# EAGLE design sdr_3157 (EAGLE 9.6.2)
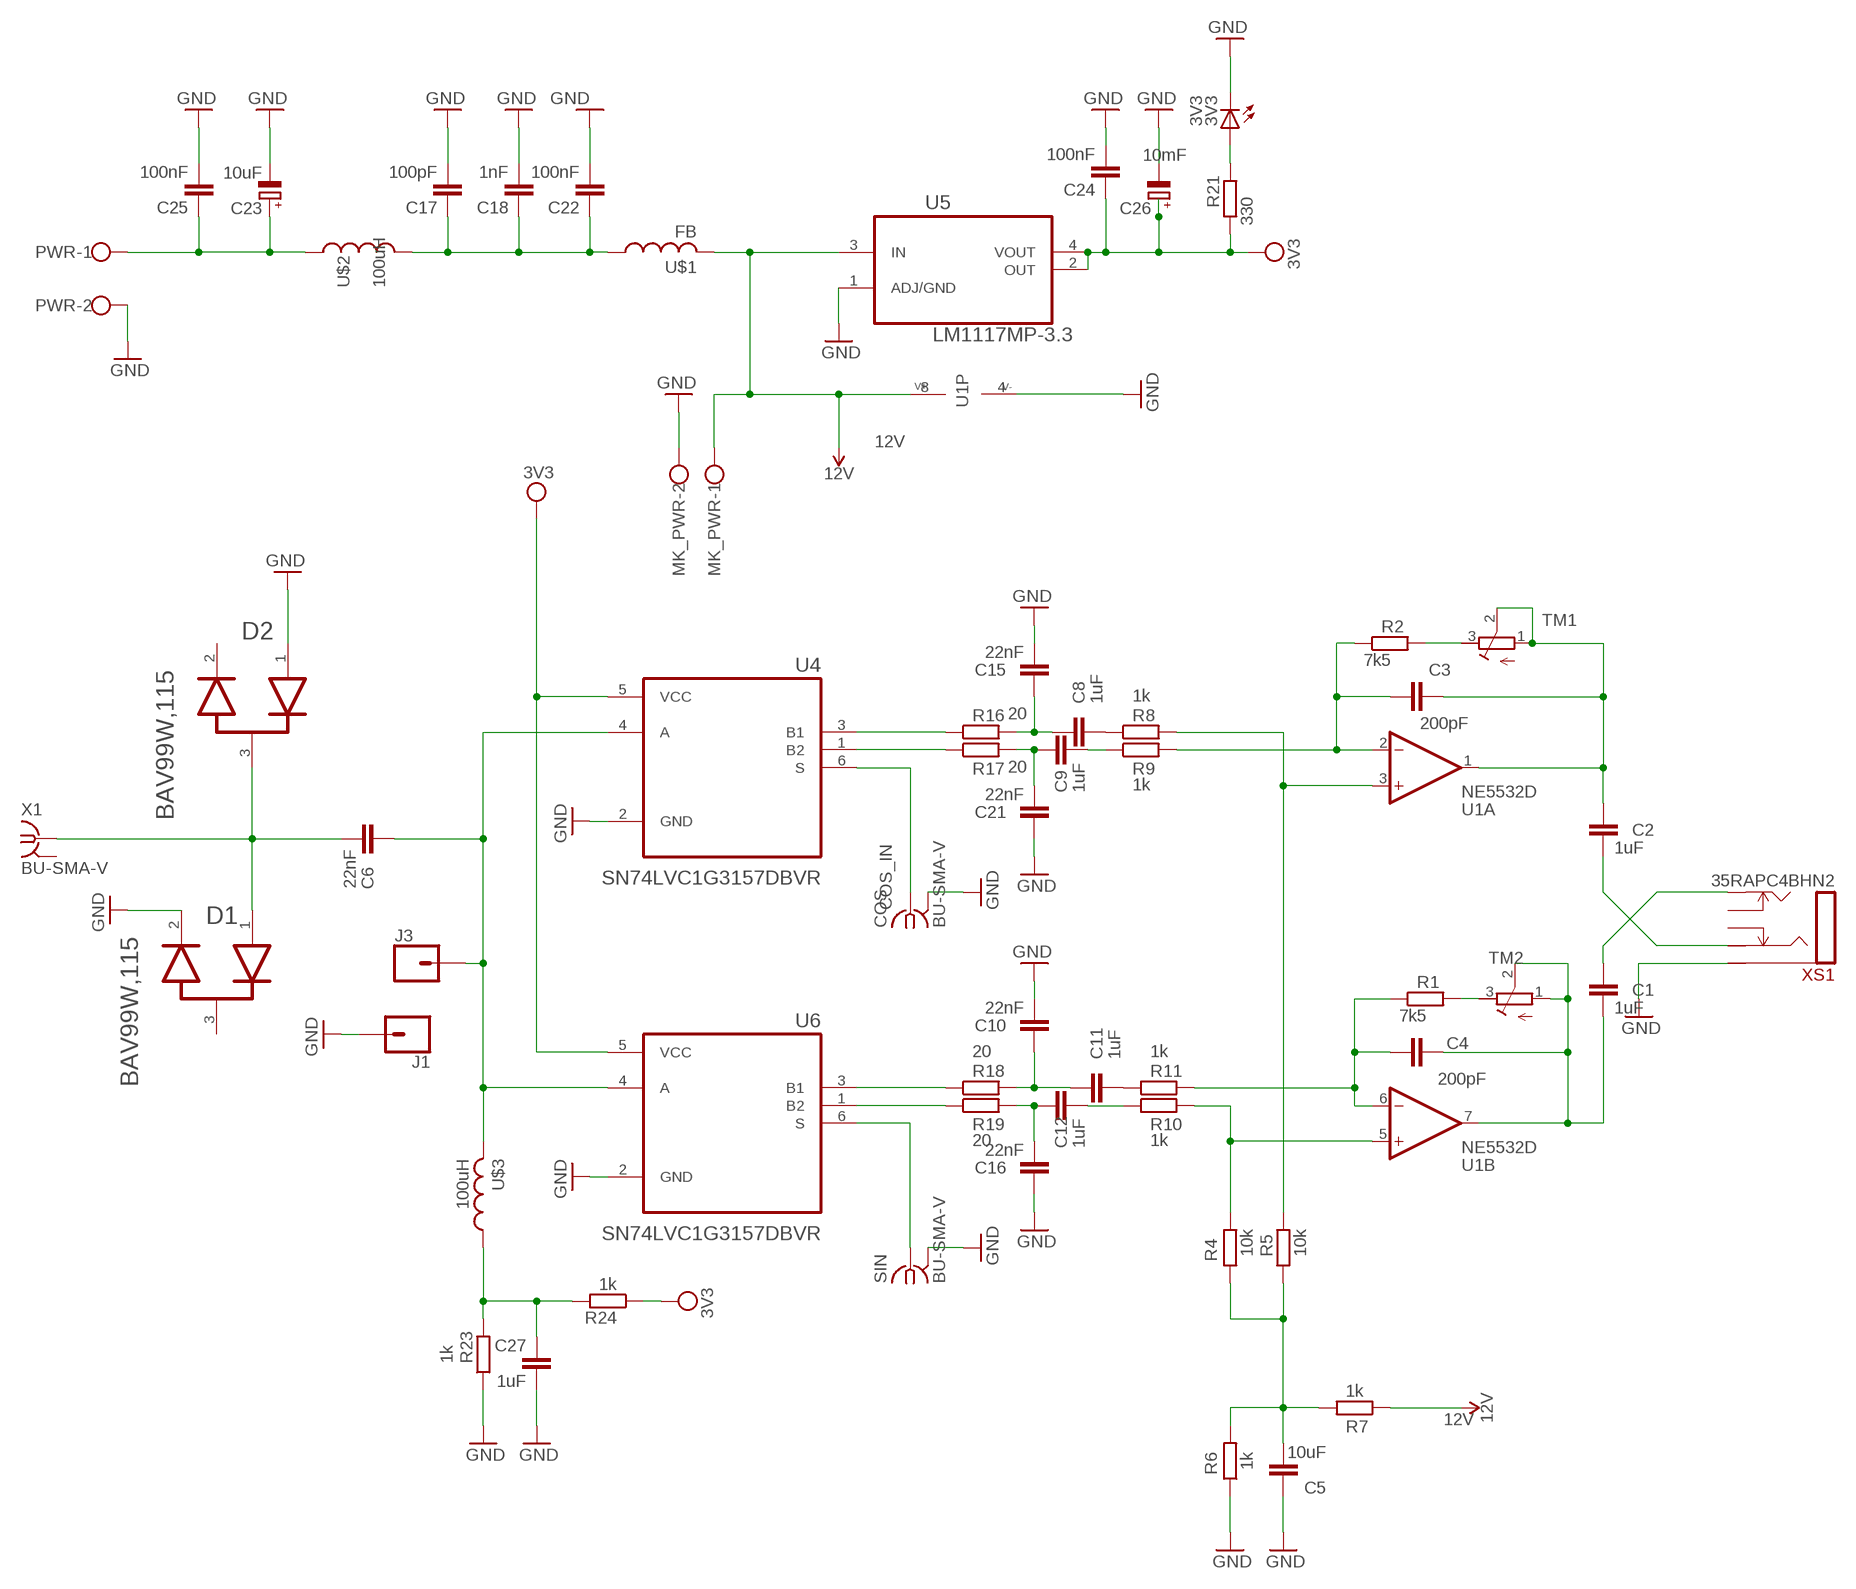
[diagram p0: schematic, sheet 1]

## Parts
3V3  3V3  LEDSMT1206  [1206]
C1  1uF  C-EU050-045X075  [C050-045X075]
C2  1uF  C-EU050-045X075  [C050-045X075]
C3  200pF  C-EU050-045X075  [C050-045X075]
C4  200pF  C-EU050-045X075  [C050-045X075]
C5  10uF  C-EUC0805  [C0805]
C6  22nF  C-EUC0805  [C0805]
C8  1uF  C-EUC0805  [C0805]
C9  1uF  C-EUC0805  [C0805]
C10  22nF  C-EUC0805  [C0805]
C11  1uF  C-EUC0805  [C0805]
C12  1uF  C-EUC0805  [C0805]
C15  22nF  C-EUC0805  [C0805]
C16  22nF  C-EUC0805  [C0805]
C17  100pF  C-EUC0805  [C0805]
C18  1nF  C-EUC0805  [C0805]
C21  22nF  C-EUC0805  [C0805]
C22  100nF  C-EUC0805  [C0805]
C23  10uF  CPOL-EUSMCC  [SMC_C]
C24  100nF  C-EUC0805  [C0805]
C25  100nF  C-EUC0805  [C0805]
C26  10mF  CPOL-EUSMCC  [SMC_C]
C27  1uF  C-EUC0805  [C0805]
COS  BU-SMA-V  [BU-SMA-V]
D1  NEXPERIA_BAV99W,115NEXPERIA_BAV99W,115_0_0  [NEXPERIA_BAV99W,115_0]
D2  NEXPERIA_BAV99W,115NEXPERIA_BAV99W,115_0_0  [NEXPERIA_BAV99W,115_0]
J1  CONN_01PTH_NO_SILK_SMALL  [1X01_SMALL]
J3  CONN_01PTH_NO_SILK_SMALL  [1X01_SMALL]
MK_PWR  W237-102  [W237-102]
PWR  W237-102  [W237-102]
R1  7k5  R-EU_R0805  [R0805]
R2  7k5  R-EU_R0805  [R0805]
R4  10k  R-EU_M0805  [M0805]
R5  10k  R-EU_R0805  [R0805]
R6  1k  R-EU_M0805  [M0805]
R7  1k  R-EU_M0805  [M0805]
R8  1k  R-EU_R0805  [R0805]
R9  1k  R-EU_R0805  [R0805]
R10  1k  R-EU_R0805  [R0805]
R11  1k  R-EU_M0805  [M0805]
R16  20  R-EU_R0805  [R0805]
R17  20  R-EU_R0805  [R0805]
R18  20  R-EU_R0805  [R0805]
R19  20  R-EU_R0805  [R0805]
R21  330  R-EU_R0805  [R0805]
R23  1k  R-EU_R0805  [R0805]
R24  1k  R-EU_R0805  [R0805]
SIN  BU-SMA-V  [BU-SMA-V]
TM1  5k  R-TRIMM3296W  [RTRIM3296W]
TM2  5k  R-TRIMM3296W  [RTRIM3296W]
U1  NE5532D  [SO08]
U4  SN74LVC1G3157DBVR  [SOT95P280X145-6N]
U5  LM1117MP-3.3  [SOT230P696X180-4N]
U6  SN74LVC1G3157DBVR  [SOT95P280X145-6N]
U$1  FB  [FB]
U$2  100uH  IHLP4040  [IHLP4040]
U$3  100uH  L-LQH55  [LQH55]
X1  BU-SMA-V  [BU-SMA-V]
XS1  35RAPC4BHN2  [35RAP]

## Nets
12V: MK_PWR.1 R7.1 U1.8(P:V+) U5.3(IN) U$1.P$2
ANTENNA: C6.1 J3.P$1 U4.4(A) U6.4(A) U$3.2
COS_IN: COS.1 U4.6(S)
GND: 3V3.C C5.1 C10.2 C15.2 C16.1 C17.2 C18.2 C21.1 C22.2 C23.- C24.2 C25.2 C26.- C27.1 COS.2 COS.3 COS.4 COS.5 D1.2(2_CATHODE) D2.1(1_ANODE) J1.P$1 MK_PWR.2 PWR.2 R6.1 R23.1 SIN.2 SIN.3 SIN.4 SIN.5 U1.4(P:V-) U4.2(GND) U5.1(ADJ/GND) U6.2(GND) XS1.1(S)
N$1: C6.2 D1.1(1_ANODE) D2.3(1_CATHODE/2_ANODE) X1.1
N$3: R16.1 U4.3(B1)
N$4: R17.1 U4.1(B2)
N$5: R18.1 U6.3(B1)
N$7: R19.1 U6.1(B2)
N$8: C8.1 C15.1 R16.2
N$9: C9.1 C21.2 R17.2
N$10: C10.1 C11.1 R18.2
N$11: C12.1 C16.2 R19.2
N$12: C8.2 R8.1
N$13: C9.2 R9.1
N$14: C11.2 R11.1
N$15: C12.2 R10.1
N$16: R5.2 R8.2 U1.3(A:+IN)
N$17: C3.1 R2.1 R9.2 U1.2(A:-IN)
N$18: R4.2 R10.2 U1.5(B:+IN)
N$19: C4.1 R1.1 R11.2 U1.6(B:-IN)
N$20: C5.2 R4.1 R5.1 R6.2 R7.2
N$21: C2.1 C3.2 TM1.1(A) TM1.2(S) U1.1(A:OUT)
N$22: C2.2 XS1.3(R)
N$23: C1.1 XS1.2(T)
N$24: C1.2 C4.2 TM2.1(A) TM2.2(S) U1.7(B:OUT)
N$25: C27.2 R23.2 R24.2 U$3.1
N$26: 3V3.A R21.2
N$28: R2.2 TM1.3(E)
N$31: SIN.1 U6.6(S)
N$32: C23.+ C25.1 PWR.1 U$2.1
N$33: C17.1 C18.1 C22.1 U$1.P$1 U$2.2
N$41: R1.2 TM2.3(E)
VCC: C24.1 C26.+ R21.1 R24.1 U4.5(VCC) U5.2(OUT) U5.4(VOUT) U6.5(VCC) ; supply symbol labelled 3V3
Unconnected: D1.3(1_CATHODE/2_ANODE) D2.2(2_CATHODE) X1.2 X1.3 X1.4 X1.5 XS1.10(TN) XS1.11(RN)

## Library data of the parts
3V3 = adafruit:LED: LED OSRAM: - CHIPLED LG R971, LG N971, LY N971, LG Q971, LY Q971, LO R971, LY R971 LH N974, LH R974 LS Q976, LO Q976, LY Q976 LO Q996 - Hyper CHIPLED LW Q18S LB Q993, LB Q99A, LB R99A - SideLED LS A670, LO A670, LY A670, LG A670, LP A670 LB A673, LV A673, LT A673, LW A673 LH A674 LY A675 LS A676, LA A676, LO A676, LY A676, LW A676 LS A679, LY A679, LG A679 - Hyper Micro SIDELED® LS Y876, LA Y876, LO Y876, LY Y876 LT Y87S - SmartLED LW L88C, LW L88S LB L89C, LB L89S, LG L890 LS L89K, LO L89K, LY L89K LS L896, LA L896, LO L896, LY L896 - TOPLED LS T670, LO T670, LY T670, LG T670, LP T670 LSG T670, LSP T670, LSY T670, LOP T670, LYG T670 LG T671, LOG T671, LSG T671 LB T673, LV T673, LT T673, LW T673 LH T674 LS T676, LA T676, LO T676, LY T676, LB T676, LH T676, LSB T676, LW T676 LB T67C, LV T67C, LT T67C, LS T67K, LO T67K, LY T67K, LW E67C LS E67B, LA E67B, LO E67B, LY E67B, LB E67C, LV E67C, LT E67C LW T67C LS T679, LY T679, LG T679 LS T770, LO T770, LY T770, LG T770, LP T770 LB T773, LV T773, LT T773, LW T773 LH T774 LS E675, LA E675, LY E675, LS T675 LS T776, LA T776, LO T776, LY T776, LB T776 LHGB T686 LT T68C, LB T68C - Hyper Mini TOPLED® LB M676 - Mini TOPLED Santana® LG M470 LS M47K, LO M47K, LY M47K Source: http://www.osram.convergy.de/
C1-C6 C8-C12 C15-C18 C21 C22 C24 C25 C27 = rcl:C-EU: CAPACITOR, European symbol; SPICEPREFIX: C
C23 C26 = rcl:CPOL-EU: POLARIZED CAPACITOR, European symbol; SPICEPREFIX: C
COS SIN X1 = con-coax:BU-SMA-V: FEMALE SMA CONNECTOR Radiall distributor RS 112-3794; OC_FARNELL: unknown; OC_NEWARK: unknown
D1 D2 = Nexperia - BAV99W,115:NEXPERIA_BAV99W,115: High-speed switching diodes; 3DS_PART_NUMBER: 412-00001; AMBIENT_TEMPERATURE_RANGE_HIGH: +150°C; AMBIENT_TEMPERATURE_RANGE_LOW: -65°C; CAPACITANCE: 1.5pF; CENTROID_NOT_SPECIFIED: No; DATASHEET: https://assets.nexperia.com/documents/data-sheet/BAV99_SER.pdf; DEVICE_CLASS_L1: Discrete Semiconductors; DEVICE_CLASS_L2: Diodes; DEVICE_CLASS_L3: Rectifier Diodes; DIGIKEY_DESCRIPTION: DIODE ARRAY GP 100V 150MA SOT323; DIGIKEY_PART_NUMBER: 1727-2915-1-ND; FOOTPRINT_PARAMETERS_0: {"fp_type":"SOT23","params":{"N":{"default":"3","long name":"Number of leads","type":"multichoice","short name":"N"},"A":{"nom":false,"long name":"Height","min":800000,"max":1100000,"short name":"A","type":"measurement"},"A1":{"nom":false,"long name":"Package clearance","min":false,"max":100000,"short name":"A1","type":"measurement"},"A2":{"nom":false,"long name":"Package height","min":false,"max":1000000,"short name":"A2","type":"measurement"},"D":{"nom":false,"long name":"Package length","min":1800000,"max":2200000,"short name":"D","type":"measurement"},"E":{"nom":false,"long name":"Width /w leads","min":2000000,"max":2200000,"short name":"E","type":"measurement"},"E1":{"nom":false,"long name":"Package width","min":1150000,"max":1350000,"short name":"E1","type":"measurement"},"B":{"nom":false,"long name":"Lead width","min":300000,"max":400000,"short name":"B","type":"measurement"},"C":{"nom":false,"long name":"Lead thickness","min":100000,"max":250000,"short name":"C","type":"measurement"},"L":{"nom":false,"long name":"Lead foot length","min":150000,"max":450000,"short name":"L","type":"measurement"},"e":{"nom":650000,"long name":"Lead pitch","min":null,"max":null,"short name":"e","type":"measurement"},"PHI":{"nom":false,"long name":"Lead angle","min":0,"max":8,"short name":"PHI","type":"measurement"},"offset x":{"nom":0,"long name":"X Center offset","min":null,"max":null,"short name":"offset x","type":"measurement"},"offset y":{"nom":0,"long name":"Y Center offset","min":null,"max":null,"short name":"offset y","type":"measurement"},"LS":{"default":"Rounded rectangle","long name":"Land shape","type":"multichoice","short name":"LS"},"LS1":{"default":"Rectangle","long name":"Land shape (Pin 1)","type":"multichoice","short name":"LS1"},"solder toe":{"nom":550000,"long name":"Solder fillet (toe)","min":null,"max":null,"short name":"solder toe","type":"fixedmeasurement"},"solder heel":{"nom":450000,"long name":"Solder fillet (heel)","min":null,"max":null,"short name":"solder heel","type":"fixedmeasurement"},"solder side":{"nom":50000,"long name":"Solder fillet (side)","min":null,"max":null,"short name":"solder side","type":"fixedmeasurement"},"courtyard":{"nom":500000,"long name":"Courtyard","min":null,"max":null,"short name":"courtyard","type":"fixedmeasurement"},"SF":{"default":"A","long name":"Packing level","type":"multichoiceparent","short name":"SF","help":"http://support.upverter.com/customer/portal/articles/978783-what-is-a-footprint-packing-level","children":["solder toe","solder heel","solder side","courtyard"]}}}; FOOTPRINT_PARAMETERS_1: {"fp_type":"SOT23","params":{"N":{"default":"3","long name":"Number of leads","type":"multichoice","short name":"N"},"A":{"nom":false,"long name":"Height","min":800000,"max":1100000,"short name":"A","type":"measurement"},"A1":{"nom":false,"long name":"Package clearance","min":false,"max":100000,"short name":"A1","type":"measurement"},"A2":{"nom":false,"long name":"Package height","min":false,"max":1000000,"short name":"A2","type":"measurement"},"D":{"nom":false,"long name":"Package length","min":1800000,"max":2200000,"short name":"D","type":"measurement"},"E":{"nom":false,"long name":"Width /w leads","min":2000000,"max":2200000,"short name":"E","type":"measurement"},"E1":{"nom":false,"long name":"Package width","min":1150000,"max":1350000,"short name":"E1","type":"measurement"},"B":{"nom":false,"long name":"Lead width","min":300000,"max":400000,"short name":"B","type":"measurement"},"C":{"nom":false,"long name":"Lead thickness","min":100000,"max":250000,"short name":"C","type":"measurement"},"L":{"nom":false,"long name":"Lead foot length","min":150000,"max":450000,"short name":"L","type":"measurement"},"e":{"nom":650000,"long name":"Lead pitch","min":null,"max":null,"short name":"e","type":"measurement"},"PHI":{"nom":false,"long name":"Lead angle","min":0,"max":8,"short name":"PHI","type":"measurement"},"offset x":{"nom":0,"long name":"X Center offset","min":null,"max":null,"short name":"offset x","type":"measurement"},"offset y":{"nom":0,"long name":"Y Center offset","min":null,"max":null,"short name":"offset y","type":"measurement"},"LS":{"default":"Rounded rectangle","long name":"Land shape","type":"multichoice","short name":"LS"},"LS1":{"default":"Rectangle","long name":"Land shape (Pin 1)","type":"multichoice","short name":"LS1"},"solder toe":{"nom":350000,"long name":"Solder fillet (toe)","min":null,"max":null,"short name":"solder toe","type":"fixedmeasurement"},"solder heel":{"nom":350000,"long name":"Solder fillet (heel)","min":null,"max":null,"short name":"solder heel","type":"fixedmeasurement"},"solder side":{"nom":30000,"long name":"Solder fillet (side)","min":null,"max":null,"short name":"solder side","type":"fixedmeasurement"},"courtyard":{"nom":250000,"long name":"Courtyard","min":null,"max":null,"short name":"courtyard","type":"fixedmeasurement"},"SF":{"default":"B","long name":"Packing level","type":"multichoiceparent","short name":"SF","help":"http://support.upverter.com/customer/portal/articles/978783-what-is-a-footprint-packing-level","children":["solder toe","solder heel","solder side","courtyard"]}}}; FOOTPRINT_PARAMETERS_2: {"fp_type":"SOT23","params":{"N":{"default":"3","long name":"Number of leads","type":"multichoice","short name":"N"},"A":{"nom":false,"long name":"Height","min":800000,"max":1100000,"short name":"A","type":"measurement"},"A1":{"nom":false,"long name":"Package clearance","min":false,"max":100000,"short name":"A1","type":"measurement"},"A2":{"nom":false,"long name":"Package height","min":false,"max":1000000,"short name":"A2","type":"measurement"},"D":{"nom":false,"long name":"Package length","min":1800000,"max":2200000,"short name":"D","type":"measurement"},"E":{"nom":false,"long name":"Width /w leads","min":2000000,"max":2200000,"short name":"E","type":"measurement"},"E1":{"nom":false,"long name":"Package width","min":1150000,"max":1350000,"short name":"E1","type":"measurement"},"B":{"nom":false,"long name":"Lead width","min":300000,"max":400000,"short name":"B","type":"measurement"},"C":{"nom":false,"long name":"Lead thickness","min":100000,"max":250000,"short name":"C","type":"measurement"},"L":{"nom":false,"long name":"Lead foot length","min":150000,"max":450000,"short name":"L","type":"measurement"},"e":{"nom":650000,"long name":"Lead pitch","min":null,"max":null,"short name":"e","type":"measurement"},"PHI":{"nom":false,"long name":"Lead angle","min":0,"max":8,"short name":"PHI","type":"measurement"},"offset x":{"nom":0,"long name":"X Center offset","min":null,"max":null,"short name":"offset x","type":"measurement"},"offset y":{"nom":0,"long name":"Y Center offset","min":null,"max":null,"short name":"offset y","type":"measurement"},"LS":{"default":"Rounded rectangle","long name":"Land shape","type":"multichoice","short name":"LS"},"LS1":{"default":"Rectangle","long name":"Land shape (Pin 1)","type":"multichoice","short name":"LS1"},"solder toe":{"nom":150000,"long name":"Solder fillet (toe)","min":null,"max":null,"short name":"solder toe","type":"fixedmeasurement"},"solder heel":{"nom":250000,"long name":"Solder fillet (heel)","min":null,"max":null,"short name":"solder heel","type":"fixedmeasurement"},"solder side":{"nom":10000,"long name":"Solder fillet (side)","min":null,"max":null,"short name":"solder side","type":"fixedmeasurement"},"courtyard":{"nom":100000,"long name":"Courtyard","min":null,"max":null,"short name":"courtyard","type":"fixedmeasurement"},"SF":{"default":"C","long name":"Packing level","type":"multichoiceparent","short name":"SF","help":"http://support.upverter.com/customer/portal/articles/978783-what-is-a-footprint-packing-level","children":["solder toe","solder heel","solder side","courtyard"]}}}; FOOTPRINT_URL: https://assets.nexperia.com/documents/outline-drawing/SOT323.pdf; FOOTPRINT_VARIANT_NAME_0: IPC_A; FOOTPRINT_VARIANT_NAME_1: IPC_B; FOOTPRINT_VARIANT_NAME_2: IPC_C; FOOTPRINT_VARIANT_NAME_3: Recommended_Land_Pattern; FORWARD_CURRENT: 130mA; HEIGHT: 1.1mm; IPC_LAND_PATTERN_NAME: SOT65P210X95-3; LEAD_FREE: yes; MAX_JUNCTION_TEMP: +150°C; MAX_REPETITIVE_REVERSE_VOLTAGE: 100V; MAX_SURGE_FORWARD_CURRENT: 4A; MF: Nexperia; MFG_PACKAGE_IDENT: SOT323; MFG_PACKAGE_IDENT_DATE: 01/2017; MFG_PACKAGE_IDENT_REV: 0; MOUSER_DESCRIPTION: Diodes - General Purpose, Power, Switching SW DBL 75V 150MA HS; MOUSER_PART_NUMBER: 771-BAV99W-T/R; MPN: BAV99W,115; PACKAGE: SOT-323; PEAK_REVERSE_CURRENT: 500mA; PREFIX: D; REVERSE_VOLTAGE: 100V; ROHS: yes; STANDOFF_HEIGHT: 0.1mm; TEMPERATURE_RANGE_HIGH: +150°C; TEMPERATURE_RANGE_LOW: -65°C; VERIFICATION_VERSION: 0.0.0.1
J1 J3 = SparkFun-Connectors:CONN_01: Single connection point. Often used as Generic Header-pin footprint for 0.1 inch spaced/style header connections On any of the 0.1 inch spaced packages, you can populate with these: Break Away Headers - Straight <https://www.sparkfun.com/products/116> (PRT-00116) Break Away Male Headers - Right Angle <https://www.sparkfun.com/products/553> (PRT-00553) Female Headers <https://www.sparkfun.com/products/115> (PRT-00115) Break Away Headers - Machine Pin <https://www.sparkfun.com/products/117> (PRT-00117) Break Away Female Headers - Swiss Machine Pin <https://www.sparkfun.com/products/743> (PRT-00743) This device is also useful as a general connection point to wire up your design to another part of your project. Our various solder wires solder well into these plated through hole pads. Hook-Up Wire - Assortment (Stranded, 22 AWG) <https://www.sparkfun.com/products/11375> (PRT-11375) Hook-Up Wire - Assortment (Solid Core, 22 AWG) <https://www.sparkfun.com/products/11367> (PRT-11367) View the entire wire category on our website here <https://www.sparkfun.com/categories/141> Special notes: SMTSO-256-ET is a "flush mount" nut for a 4-40 screw. We mostly use this on specialty testbeds; it is a nice way to connect hardware to your PCB at an adjustable hieght. Also note, the SNAP packages are for using a snappable style connector. We sell a baggie of snaps and they are also used on two LilyPad designs: Snap Assortment - 30 pack (male and female) <https://www.sparkfun.com/products/11347> (DEV-11347) LilyPad Arduino SimpleSnap <https://www.sparkfun.com/products/10941> (DEV-10941) LilyPad SimpleSnap Protoboard <https://www.sparkfun.com/products/10940> (DEV-10940)
MK_PWR PWR = con-wago-500:W237-102: WAGO SCREW CLAMP; MPN: 237-102; OC_FARNELL: unknown; OC_NEWARK: 70K9898
R1 R2 R4-R11 R16-R19 R21 R23 R24 = rcl:R-EU_: RESISTOR, European symbol; SPICEPREFIX: R
TM1 TM2 = rcl:R-TRIMM: Trimm resistor; SPICEMODEL: X; SPICEPREFIXL: POT
U1 = op-amp:NE5532: OP-AMP
U4 U6 = SN74LVC1G3157DBVR:SN74LVC1G3157DBVR: Check prices <https://pricing.snapeda.com/parts/SN74LVC1G3157DBVR/Texas%20Instruments/view-part?ref=eda>; AVAILABILITY: In Stock; DESCRIPTION: 5-V, 2:1 (SPDT), 1-channel general-purpose analog switch 6-SOT-23 -40 to 125; MF: Texas Instruments; MP: SN74LVC1G3157DBVR; PACKAGE: SOT-23-6 Texas Instruments; PRICE: None; PURCHASE-URL: https://pricing.snapeda.com/search/part/SN74LVC1G3157DBVR/?ref=eda
U5 = LM1117MP-3.3:LM1117MP-3.3: Linear regulators Check prices <https://pricing.snapeda.com/parts/LM1117MP-3.3/Texas%20Instruments/view-part?ref=eda>; AVAILABILITY: In Stock; DESCRIPTION: Linear Voltage Regulator IC Positive Fixed 1 Output 800mA SOT-223; MF: Texas Instruments; MP: LM1117MP-3.3; PACKAGE: SOT-223-3 Texas Instruments; PRICE: None; PURCHASE-URL: https://pricing.snapeda.com/search/part/LM1117MP-3.3/?ref=eda
U$1 = adafruit:FB: Ferrite bead Digikey #P9821BK-ND
U$2 = smd-inductors:IHLP4040
U$3 = adafruit:L
XS1 = connectors:35RAPC4BHN2; MOUSER: 502-35RAPC4BHN2

## Board
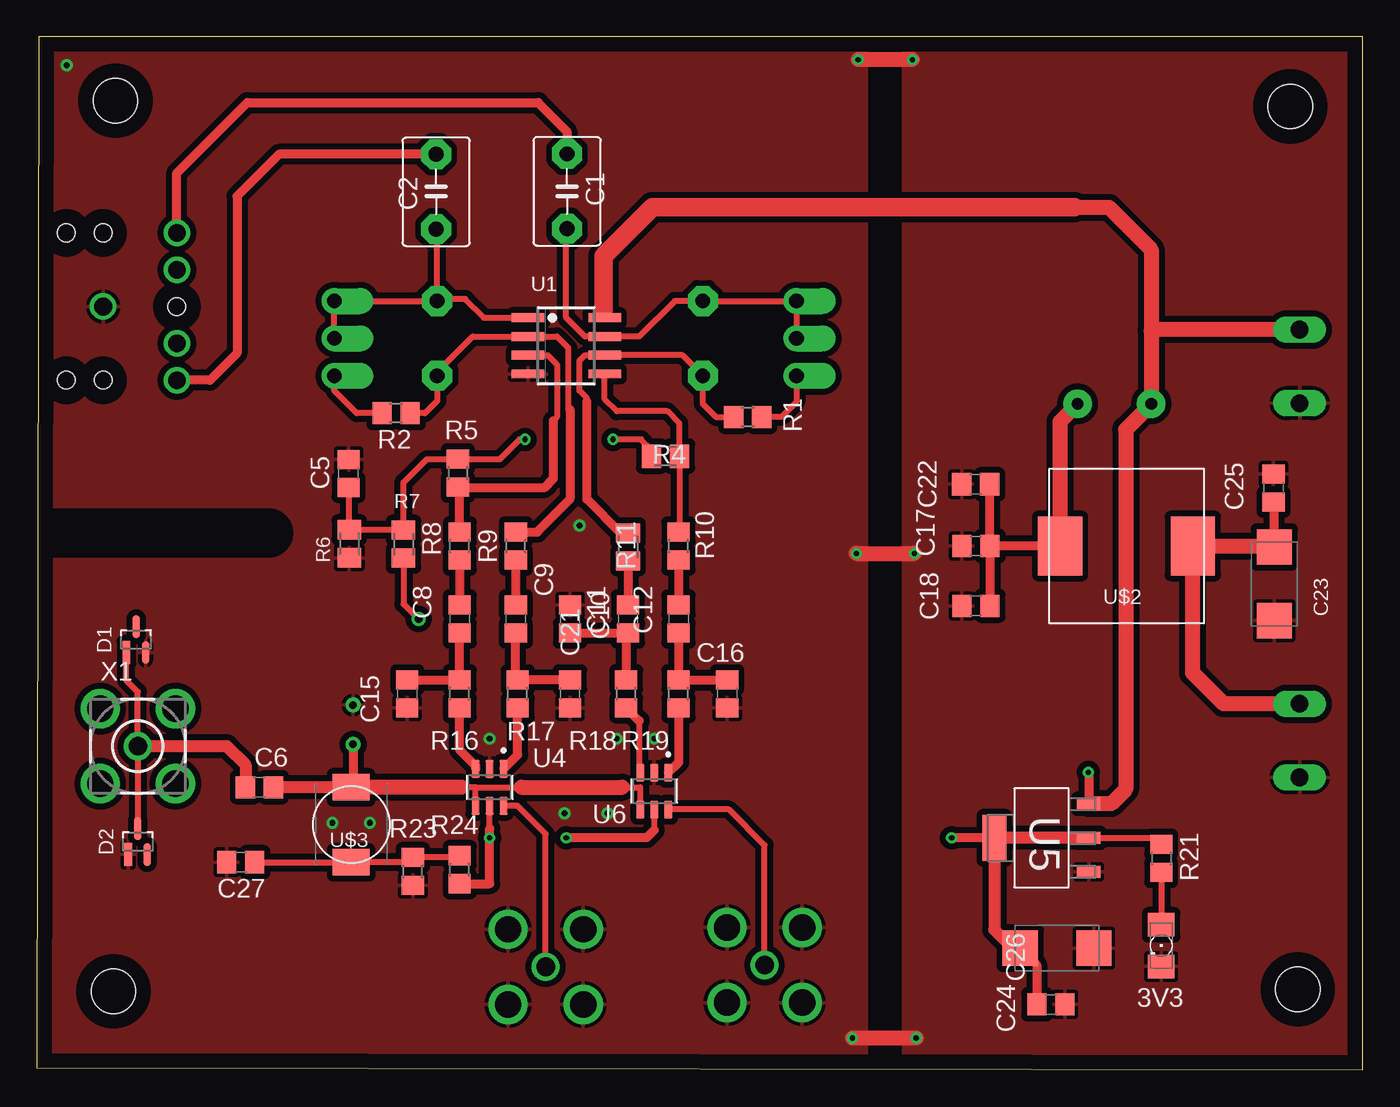
[diagram p1: board, top side]
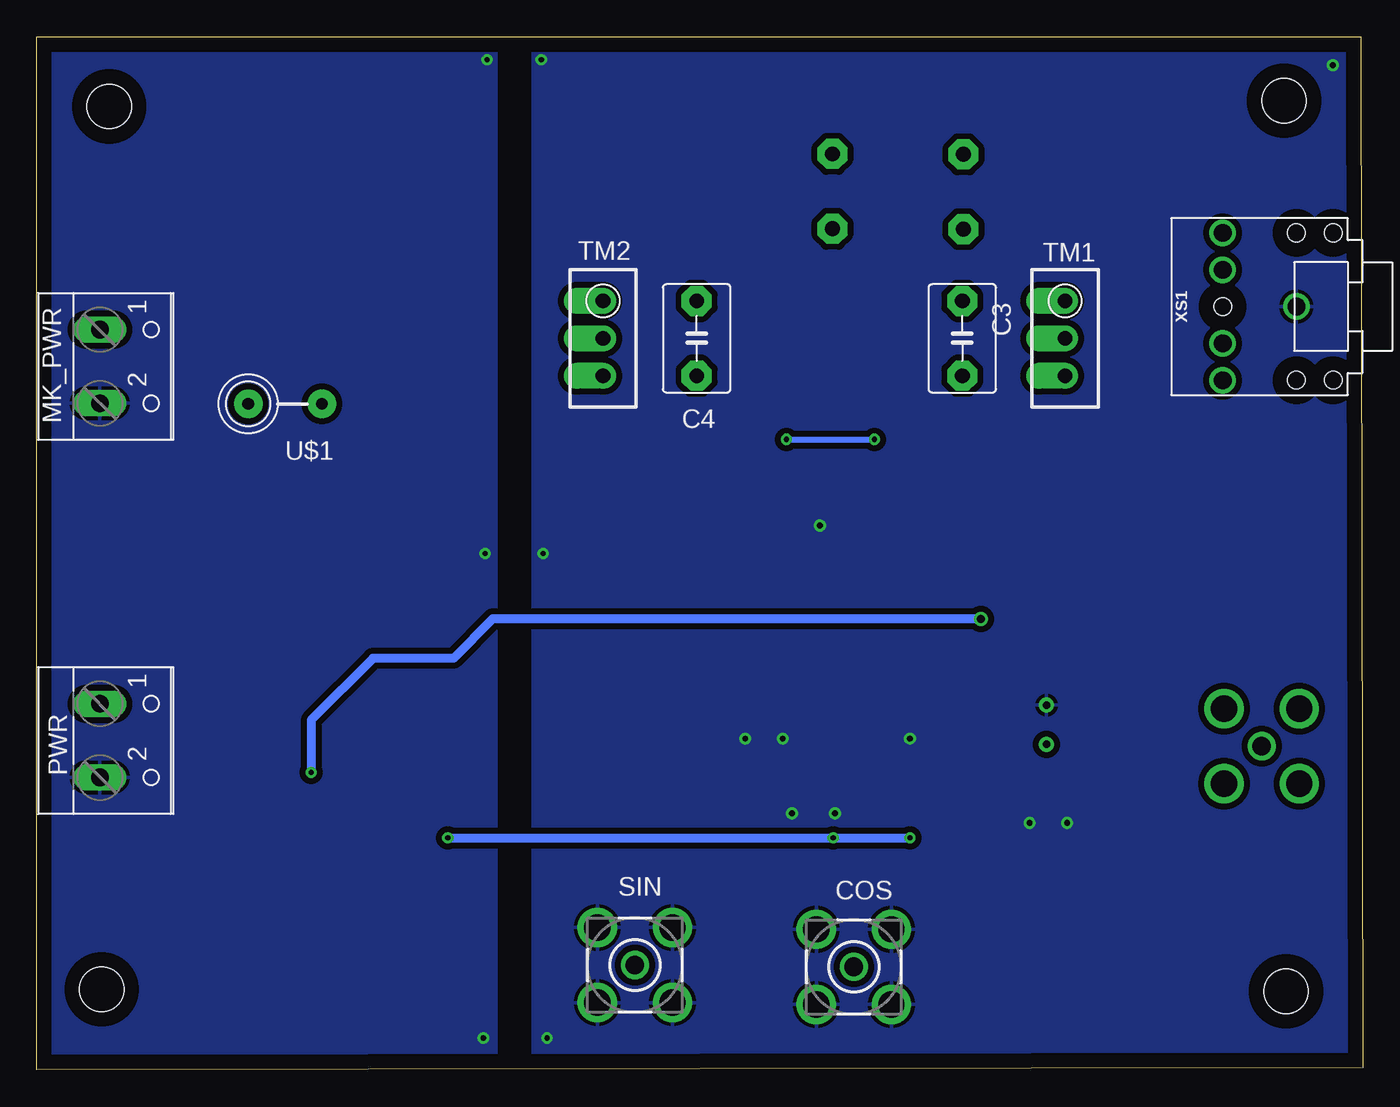
[diagram p2: board, bottom side, seen from below]

Size 90 x 70.13 mm. Coordinates in mm from the lower left corner, seen from the top.
Outline: 0,0.13 90,0 90,70.13 0.13,70.13 0,0.13
Copper layers (1*16): Top 0.035mm / dielectric 1.5mm / Bottom 0.035mm
Design rules "default": minimum track width 6mil, minimum drill 0.35mm, track to track 6mil, track to pad 6mil, pad to pad 6mil, via to via 6mil, smd to smd 6mil, copper to edge 40mil, drill to drill 6mil, minimum pad ring 10mil, minimum via ring 8mil, stop-mask expansion 4mil, vias tented up to drill 0mil, thermal gap 10mil
Holes 3 mm at 5.21,5.33 5.33,65.79 85.09,65.41 85.6,5.46
tRestrict: 2 lines

### Footprints (pad centres in the part's own frame; a part is rotated, then mirrored left to right if it is on the bottom)
1206 = smd 1.6 x 1.803: A -1.422,0; C 1.422,0
C050-045X075 = drill 1 pad 2.032 octagon: 1 -2.54,0; 2 2.54,0
C0805 = smd 1.3 x 1.5: 1 -0.95,0; 2 0.95,0
SMC_C = smd 2.4 x 2.4: + -2.5,0; - 2.5,0
BU-SMA-V = drill 1.27: 1 0,0 | drill 1.778: 2 -2.55,2.55; 3 2.55,2.55; 4 2.55,-2.55; 5 -2.55,-2.55
NEXPERIA_BAV99W,115_0 = smd 1.559 x 0.522: 1 -0.877,0.65; 2 -0.877,-0.65; 3 0.877,0
1X01_SMALL = drill 0.508: P$1 0,0
W237-102 = drill 1.194 long: 1 -2.5,-1.27; 2 2.5,-1.27
R0805 = smd 1.3 x 1.5: 1 -0.95,0; 2 0.95,0
M0805 = smd 1.3 x 1.6: 1 -0.95,0; 2 0.95,0
RTRIM3296W = drill 1 pad 1.778 offset: 1 0,-2.54; 2 0,0; 3 0,2.54
SO08 = smd 0.6 x 2.2: 1 -1.905,-2.6; 2 -0.635,-2.6; 3 0.635,-2.6; 4 1.905,-2.6; 5 1.905,2.6; 6 0.635,2.6; 7 -0.635,2.6; 8 -1.905,2.6
SOT95P280X145-6N = smd 1.21 x 0.58: 1 -1.255,0.95; 2 -1.255,0; 3 -1.255,-0.95; 4 1.255,-0.95; 5 1.255,0; 6 1.255,0.95
SOT230P696X180-4N = smd 1.6 x 0.838: 1 -3.2,2.311; 2 -3.2,0; 3 -3.2,-2.311 | smd 1.6 x 3.099: 4 3.2,0
FB = drill 0.8 pad 1.93: P$1 -2.5,0; P$2 2.5,0
IHLP4040 = smd 3 x 4: 1 -4.5,0; 2 4.5,0
LQH55 = smd 1.8 x 2.5: 1 -2.55,0; 2 2.55,0
35RAP = drill 1.2: 1 4.5,0; 2 9.5,-5; 3 9.5,5; 10 9.5,-2.5; 11 9.5,2.5 | hole 1.2: 2,5; 2,-5; 4.5,5; 4.5,-5; 9.5,0

### Placement (x,y rotation side)
3V3  76.33,8.43 270 top
C1  35.99,59.64 270 top
C2  27.1,59.61 90 top
C3  27.18,49.66 90 bottom
C4  45.21,49.66 90 bottom
C5  21.16,40.49 270 top
C6  15.11,19.18 180 top
C8  28.7,30.61 90 top
C9  32.51,30.61 90 top
C10  36.2,30.61 90 top
C11  40.13,30.61 90 top
C12  43.56,30.61 90 top
C15  25.15,25.53 270 top
C16  46.86,25.53 90 top
C17  63.75,35.56 180 top
C18  63.75,31.5 180 top
C21  36.2,25.53 90 top
C22  63.73,39.75 180 top
C23  84,32.99 270 top
C24  68.83,4.44 0 top
C25  83.95,39.5 90 top
C26  69.25,8.26 0 top
C27  13.84,14.1 0 top
COS  34.54,6.98 0 bottom
D1  6.73,29.21 90 top
D2  6.86,15.49 90 top
J1  21.46,24.77 0 top
J3  21.46,22.1 0 top
MK_PWR  84.45,47.75 270 bottom
PWR  84.45,22.35 270 bottom
R1  48.26,44.32 0 top
R2  24.38,44.58 180 top
R4  42.67,41.66 0 top
R5  28.57,40.51 270 top
R6  21.21,35.71 90 top
R7  24.89,35.69 90 top
R8  28.7,35.56 90 top
R9  32.51,35.56 90 top
R10  43.56,35.56 90 top
R11  40.13,35.5 90 top
R16  28.7,25.53 90 top
R17  32.64,25.53 90 top
R18  40.01,25.53 90 top
R19  43.56,25.53 90 top
R21  76.33,14.35 270 top
R23  25.53,13.46 90 top
R24  28.7,13.59 90 top
SIN  49.4,7.11 0 bottom
TM1  20.19,49.66 180 bottom
TM2  51.56,49.66 180 bottom
U1  35.94,49.15 270 top
U4  30.73,19.18 270 top
U5  68.2,15.75 180 top
U6  41.91,18.92 270 top
U$1  73.15,45.21 180 bottom
U$2  73.97,35.56 180 top
U$3  21.34,16.64 90 top
X1  6.86,21.97 0 top
XS1  0,51.82 180 bottom

### Tracks (layer width: path | path; a pad name or v marks a point on that pad's centre or on a via)
12V  (via drill 0.35, 0.55)
  Top 0.406: R7.1 24.89,31.62 v25.91,30.61
  Top 0.61: 38.48,51.56 38.48,51.11 U1.8 | v71.37,20.19 71.4,20.17 U5.3
  Top 1.016: 70.44,58.55 72.77,58.55 75.65,55.67 75.65,50.16 | 75.65,50.16 U$1.P$2 73.91,43.47 73.91,19.05 72.92,18.06 U5.3 | MK_PWR.1 75.74,50.25 75.65,50.16
  Top 1.27: 38.48,51.56 38.48,55.25 41.78,58.55 70.44,58.55
  Bottom 0.61: v25.91,30.61 59.05,30.61 61.72,27.94 67.18,27.94 71.37,23.75 v71.37,20.19
ANTENNA
  Top 0.406: U6.4 40.96,19.18 39.75,19.18 | U4.4 29.78,19.18 | 29.78,19.18 28.83,19.18 | 29.78,19.18 32.89,19.18
  Top 0.61: J3.P$1 21.46,19.29
  Top 0.813: U$3.2 C6.1
  Top 1.016: 28.83,19.18 U$3.2 | U$3.2 | 32.89,19.18 39.75,19.18 | 21.46,19.29 U$3.2 | U$3.2 21.22,19.05
COS_IN
  Top 0.406: COS.1 34.54,16 32.62,17.92 U4.6
GND  (via drill 0.35, 0.4)
  Top 1.016: v55.37,2.16 v59.69,2.16 | v59.44,68.58 v55.75,68.58 | v55.63,35.05 v59.56,35.05
  other vias: 30.73,22.48 39.37,22.48 36.83,36.96 41.91,22.48 20.07,16.76 22.61,16.76 35.81,17.4 38.73,17.4 2.03,68.2
  pour Top (isolate 0.406): -5.33,73.15 -5.33,-2.79 56.39,-2.79 56.39,73.15
  pour Bottom (isolate 0.406): 56.39,-4.57 -2.92,-4.57 -2.92,73.28 56.39,73.28
  pour Top (isolate 0.406): 103.63,-2.54 58.8,-2.54 58.8,74.3 103.63,74.3
  pour Bottom (isolate 0.406): 58.8,71.63 58.8,-2.16 103.5,-2.16 103.5,71.63
N$1
  Top 0.406: D2.3 X1.1 6.86,25.65 6.08,26.43 D1.1
  Top 0.813: C6.2 14.16,20.7 12.89,21.97 X1.1
N$3
  Top 0.61: U4.3 29.78,20.63 28.7,21.72 R16.1
N$4
  Top 0.61: U4.1 32.64,21.39 R17.1
N$5
  Top 0.406: U6.3 40.89,20.24 40.89,23.69
  Top 0.61: R18.1 40.89,23.69
N$7
  Top 0.61: R19.1 43.56,20.88 U6.1
N$8
  Top 0.61: C15.1 R16.2 C8.1
N$9
  Top 0.61: C9.1 32.51,26.6 R17.2 C21.2
N$10
  Top 0.61: R18.2 40.01,29.53 C11.1 C10.1
N$11
  Top 0.61: C12.1 R19.2 C16.2
N$12
  Top 0.61: R8.1 C8.2
N$13
  Top 0.61: R9.1 C9.2
N$14
  Top 0.61: R11.1 C11.2
N$15
  Top 0.61: R10.1 C12.2
N$16
  Top 0.406: 35.05,44.07 35.31,44.32 35.31,47.88 34.67,48.51 U1.3
  Top 0.61: R8.2 28.7,39.5 | R5.2 28.57,39.5 28.7,39.5 | 35.05,44.07 35.05,40.13 34.42,39.5 28.7,39.5
N$17
  Top 0.406: 36.2,44.83 36.07,44.96 36.07,49.02 35.31,49.78 U1.2 29.59,49.78 27.18,47.37 C3.1 27.18,45.41 26.35,44.58 R2.1
  Top 0.61: R2.1 25.33,44.93 | 36.2,44.83 36.2,38.73 33.97,36.51 R9.2
N$18
  Top 0.406: R10.2 43.62,36.57 R4.2 43.62,43.88 42.8,44.7 39.37,44.7 38.54,45.53 U1.5
N$19
  Top 0.406: 37.34,45.34 37.34,45.59 36.83,46.1 36.83,48.13 37.21,48.51 U1.6 43.81,48.51 C4.1 45.21,45.21 46.1,44.32 R1.1
  Top 0.61: R11.2 39.62,36.45 37.34,38.73 37.34,45.34
N$20  (via drill 0.35)
  Top 0.406: C5.2 21.21,39.49 R6.2 21.23,36.64 R7.2 24.89,39.88 26.48,41.46 R5.1 31.43,41.46 32.77,42.8 v33.15,42.8 | R4.1 41.72,42.1 41.02,42.8 v39.12,42.8
  Top 0.61: 28.64,41.46 R5.1 28.51,41.4 | R7.2 24.73,36.79
  Bottom 0.406: v39.12,42.8 v33.15,42.8
N$21
  Top 0.406: U1.1 30.35,51.05 29.08,52.32 27.18,52.32 27.05,52.2 | TM1.2 TM1.1 27.05,52.2 | 27.05,52.2 C3.2 27.18,57 C2.1
N$22
  Top 0.61: C2.2 16.43,62.15 13.59,59.31 13.59,48.64 11.76,46.82 XS1.3
N$23
  Top 0.61: XS1.2 9.5,60.88 14.28,65.66 34.04,65.66 35.99,63.7 C1.1
N$24
  Top 0.406: TM2.2 TM2.1 C4.2 43.31,52.2 40.89,49.78 U1.7 37.21,49.78 35.94,51.05 35.94,57.05 C1.2
N$25
  Top 0.406: R24.2 28.57,14.41 R23.2 25.2,14.09 U$3.1 21.33,14.1 C27.2
N$26
  Top 0.406: R21.2 3V3.A
N$28
  Top 0.406: R2.2 21.72,44.58 20.19,46.1 TM1.3
N$31
  Top 0.406: SIN.1 49.4,15.24 46.98,17.67 U6.6
N$32
  Top 0.61: C23.+ 84,38.5 C25.1
  Top 1.016: C23.+ 83.93,35.56 U$2.1 78.47,26.94 80.56,24.85 PWR.1
N$33
  Top 0.61: 64.68,35.59 C17.1 | U$2.2 C17.1 | C17.1 64.7,39.73 C22.1 | C17.1 C18.1
  Top 1.016: U$2.2 69.47,44.03 U$1.P$1
N$41
  Top 0.406: R1.2 50.55,44.32 51.56,45.34 TM2.3
VCC  (via drill 0.35)
  Top 0.406: U5.2 75.88,15.75 R21.1 | U6.5 41.91,16.26 | 30.73,16.38 U4.5
  Top 0.61: C26.+ 67.88,7.13 C24.1 | 41.91,16.26 41.4,15.75 v35.94,15.75 | 30.73,16.38 v30.73,15.75 30.73,12.64 R24.1 | U5.4 v62.1,15.75
  Top 0.813: U5.2 U5.4 65,9.5 66.25,8.26 C26.+
  Bottom 0.61: v30.73,15.75 v35.94,15.75 v62.1,15.75